# Altium project PCB_Project_IMX7.PrjPCB (part 7 of 9)
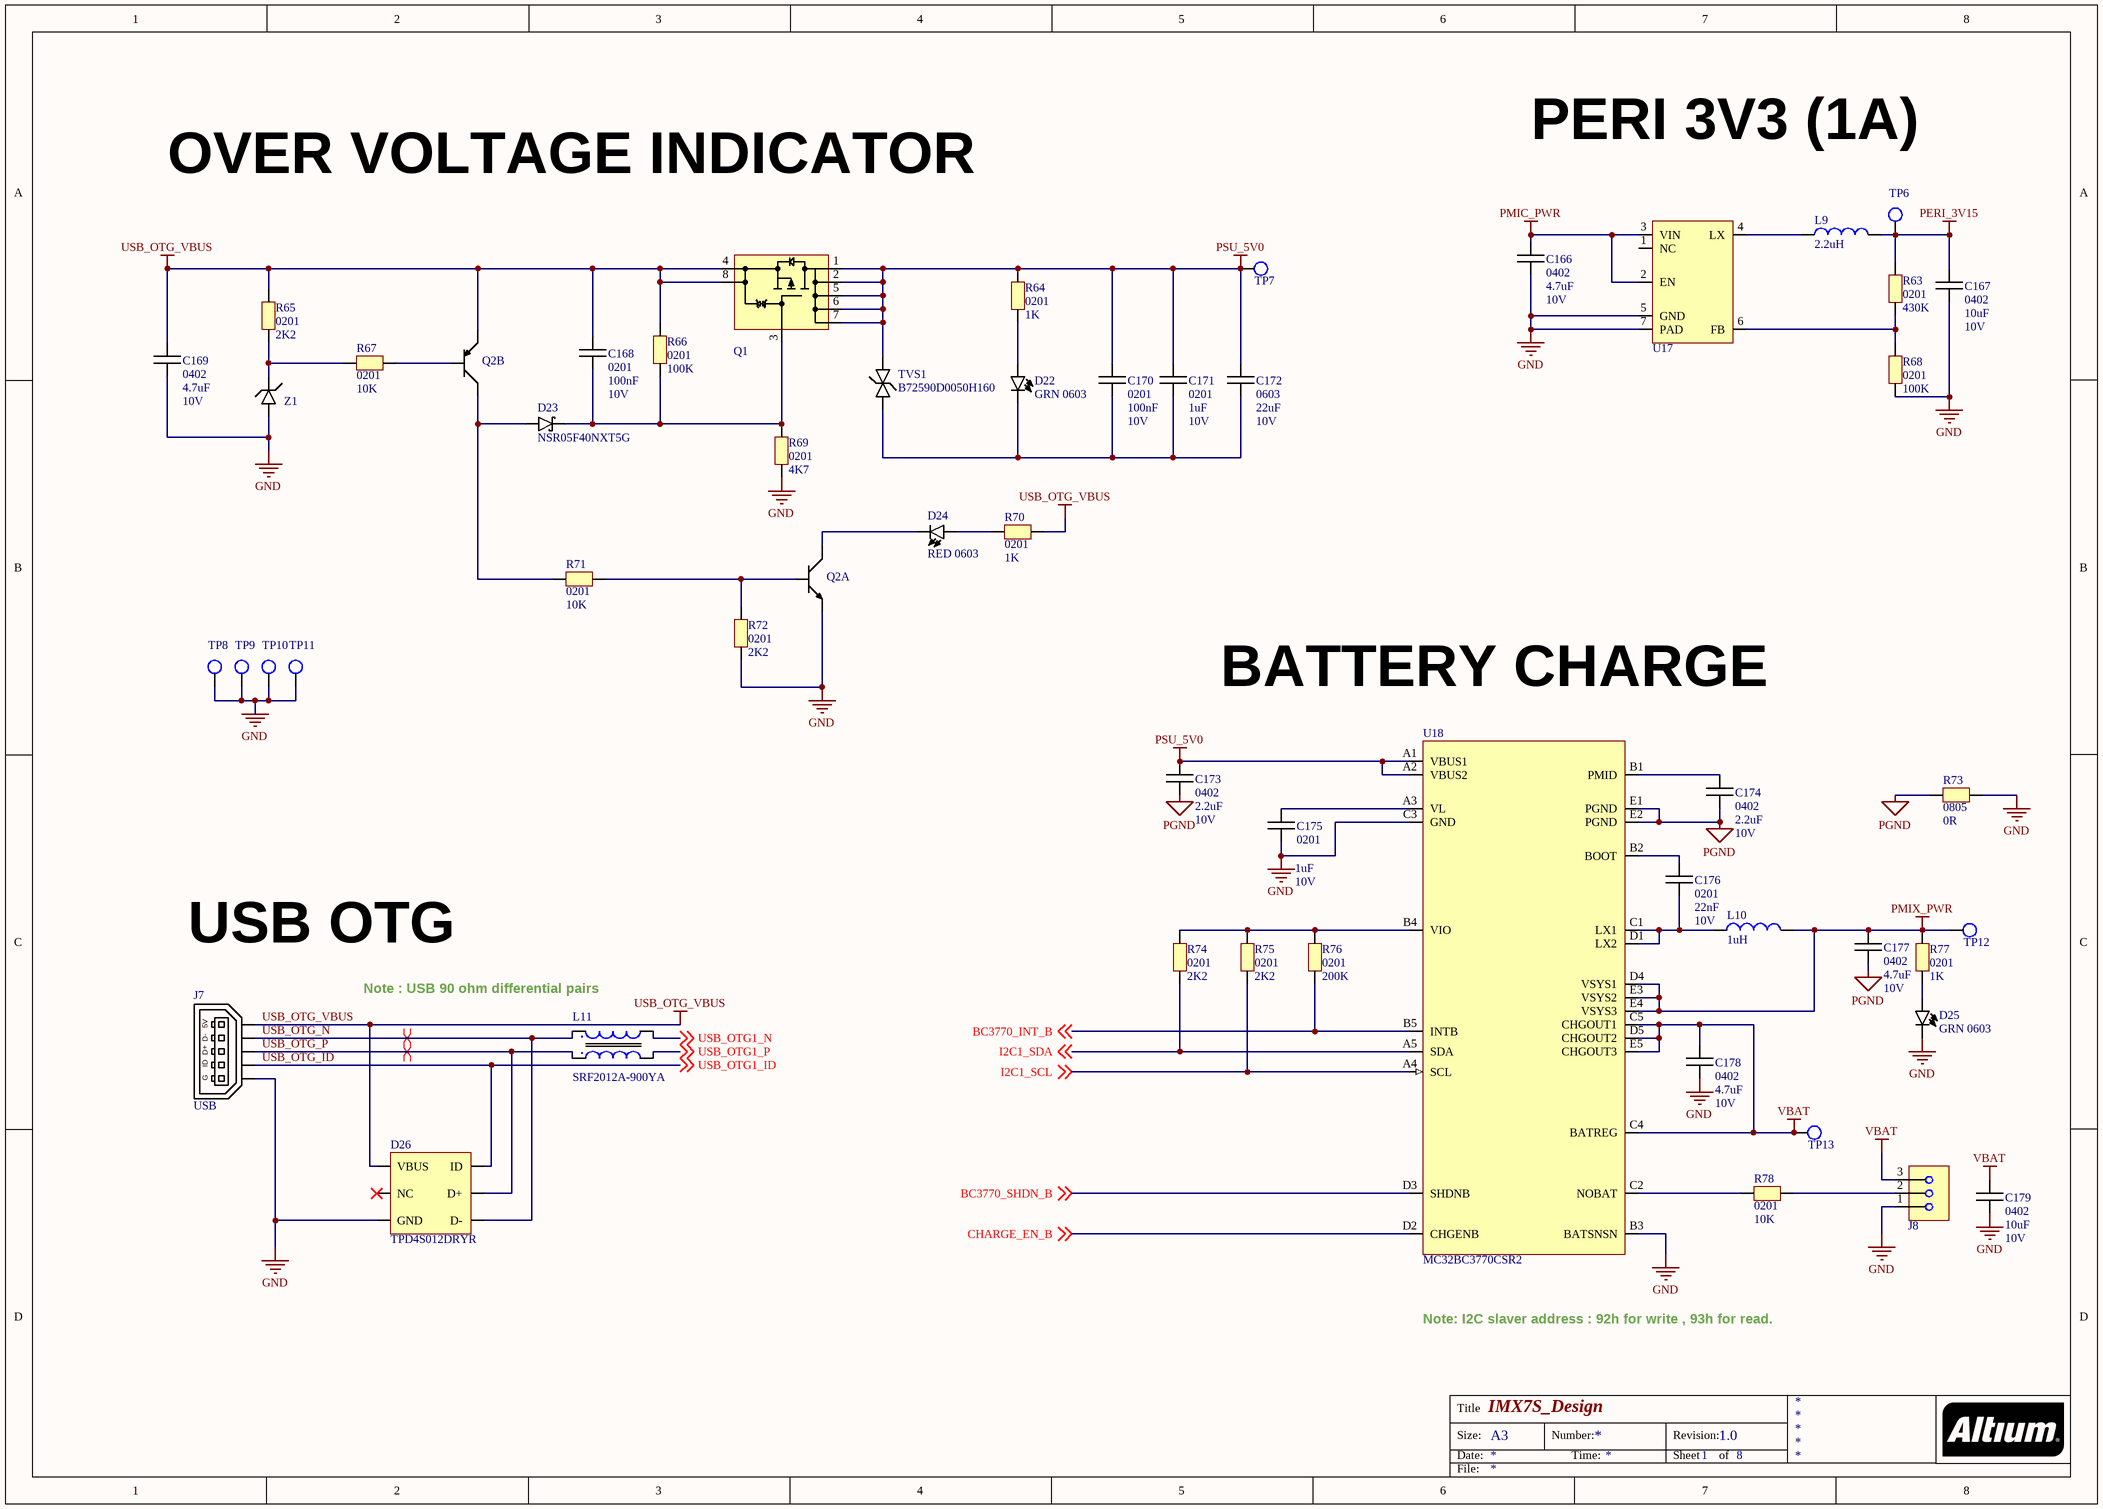
[diagram p111: IMX7S_POWER.SchDoc]

## Sheet IMX7S_POWER.SchDoc: IMX7S_Design (continued)

### Library data of the parts
C166 C169 C177 C178 = C0402: as C151 on sheet IMX7S_WIRELESS; Supplier 1: Farnell; Supplier Part Number 1: 2688503; Stock 1: 566816; Pricing 1: 10=0,19300, 100=0,08330, 500=0,05910, 2500=0,04130, 5000=0,03540, 10000=0,02750, 50000=0,02700 (EUR); Case/Package: 0402; ComponentLink1URL: http://www.farnell.com/datasheets/2189109.pdf?src-supplier=Farnell; ComponentLink1Description: http://www.farnell.com/datasheets/2189109.pdf?src-supplier=Farnell; ComponentLink2URL: https://search.murata.co.jp/Ceramy/image/img/A01X/G101/ENG/GRM155R61A475MEAA-01.pdf?src-supplier=Digi-Key; ComponentLink2Description: https://search.murata.co.jp/Ceramy/image/img/A01X/G101/ENG/GRM155R61A475MEAA-01.pdf?src-supplier=Digi-Key; ComponentLink3URL: http://datasheet.octopart.com/GRM155R61A475MEAAD-Murata-datasheet-68589269.pdf?src-supplier=Newark; ComponentLink3Description: http://datasheet.octopart.com/GRM155R61A475MEAAD-Murata-datasheet-68589269.pdf?src-supplier=Newark; ComponentLink4URL: http://datasheet.octopart.com/GRM155R61A475MEAAD-Murata-datasheet-8819587.pdf; ComponentLink4Description: http://datasheet.octopart.com/GRM155R61A475MEAAD-Murata-datasheet-8819587.pdf; ComponentLink5URL: http://datasheet.octopart.com/GRM155R61A475MEAAD-Murata-datasheet-10025737.pdf; ComponentLink5Description: http://datasheet.octopart.com/GRM155R61A475MEAAD-Murata-datasheet-10025737.pdf; ComponentLink6URL: http://datasheet.octopart.com/GRM155R61A475MEAAD-Murata-datasheet-11978611.pdf; ComponentLink6Description: http://datasheet.octopart.com/GRM155R61A475MEAAD-Murata-datasheet-11978611.pdf; ComponentLink7URL: http://datasheet.octopart.com/GRM155R61A475MEAAD-Murata-datasheet-12510076.pdf; ComponentLink7Description: http://datasheet.octopart.com/GRM155R61A475MEAAD-Murata-datasheet-12510076.pdf; ComponentLink8URL: http://datasheet.octopart.com/GRM155R61A475MEAAD-Murata-datasheet-12515295.pdf; ComponentLink8Description: http://datasheet.octopart.com/GRM155R61A475MEAAD-Murata-datasheet-12515295.pdf
C167 = C0402: Manufacturer 1: Murata; Manufacturer Part Number 1: GRM155R60J106ME44D; Description: Smd Multilayer Ceramic Capacitor, Grm Series, 10 F, 20%, X5r, 6.3 V, 0402 [1005 Metric]; Tolerance: 20%; Voltage Rating: 6.3V; Dielectric: X5R; Supplier 1: Farnell; Supplier Part Number 1: 2666402; Stock 1: 2030000; Pricing 1: 10000=0,05500, 50000=0,04130 (EUR); RoHS: Yes; Mount: Surface Mount; Case/Package: 0402; Case Code (Imperial): 0402; Case Code (Metric): 1005; Min Operating Temperature: -55°C; Max Operating Temperature: 85°C; Packaging: Tape and Reel; Package Quantity: 10000; Capacitance: 10uF; Voltage Rating (DC): 6.3V; Termination: SMD/SMT; Length: 1mm; Height: 0.5mm; Width: 0.5mm; Thickness: 0.022inch; Depth: 0.5mm; REACH SVHC: No SVHC; Lead Free: Lead Free; ComponentLink1URL: http://www.mouser.com/ds/2/281/c02e-2905.pdf?src-supplier=Mouser; ComponentLink1Description: http://www.mouser.com/ds/2/281/c02e-2905.pdf?src-supplier=Mouser; ComponentLink2URL: http://www.farnell.com/datasheets/1666664.pdf?src-supplier=Farnell; ComponentLink2Description: http://www.farnell.com/datasheets/1666664.pdf?src-supplier=Farnell; ComponentLink3URL: http://components.arrow.com/part/dataview/50476202S8987292N2606?src-supplier=Arrow; ComponentLink3Description: http://components.arrow.com/part/dataview/50476202S8987292N2606?src-supplier=Arrow; ComponentLink4URL: http://uk.rs-online.com/webdocs/13b3/0900766b813b3e5a.pdf?src-supplier=RSComponents; ComponentLink4Description: http://uk.rs-online.com/webdocs/13b3/0900766b813b3e5a.pdf?src-supplier=RSComponents; ComponentLink5URL: http://www.farnell.com/datasheets/1889704.pdf?src-supplier=Farnell; ComponentLink5Description: http://www.farnell.com/datasheets/1889704.pdf?src-supplier=Farnell; ComponentLink6URL: http://components.arrow.com/part/dataview/0323_07121522?src-supplier=Arrow+Europe; ComponentLink6Description: http://components.arrow.com/part/dataview/0323_07121522?src-supplier=Arrow+Europe; ComponentLink7URL: http://www.farnell.com/datasheets/1889704.pdf?src-supplier=Element14; ComponentLink7Description: http://www.farnell.com/datasheets/1889704.pdf?src-supplier=Element14; ComponentLink8URL: http://www.murata.com/en-global/about/newsroom/news/product/capacitor/2010/0510?src-supplier=Avnet; ComponentLink8Description: http://www.murata.com/en-global/about/newsroom/news/product/capacitor/2010/0510?src-supplier=Avnet; ComponentLink9URL: https://www.murata.com/~/media/webrenewal/support/library/catalog/products/capacitor/mlcc/c02e.ashx?la=en-us&src-supplier=Digi-Key; ComponentLink9Description: https://www.murata.com/~/media/webrenewal/support/library/catalog/products/capacitor/mlcc/c02e.ashx?la=en-us&src-supplier=Digi-Key; ComponentLink10URL: http://www.farnell.com/datasheets/1889704.pdf?src-supplier=Newark; ComponentLink10Description: http://www.farnell.com/datasheets/1889704.pdf?src-supplier=Newark
C168 C170 = C0201: as C136-C138 on sheet IMX7S_SENSORS_&_EXTERNAL_INTERFACES; Supplier 1: Farnell; Supplier Part Number 1: 2666355; Stock 1: 2430000; Pricing 1: 15000=0,00510, 75000=0,00310 (EUR); RoHS: Yes; Mount: Surface Mount; Case/Package: 0201; Weight: 6E-06oz; Case Code (Metric): 0603; Case Code (Imperial): 0201; Min Operating Temperature: -55°C; Max Operating Temperature: 85°C; Packaging: Tape and Reel; Capacitance: 100nF; Package Quantity: 1; Voltage Rating (DC): 10V; Termination: SMD/SMT; Voltage Rating: 10V; Length: 0.6mm; Height: 0.3mm; Width: 0.012inch; Thickness: 0.013inch; Depth: 0.3mm; Radiation Hardening: No; REACH SVHC: No SVHC; Lead Free: Lead Free; ComponentLink1URL: https://datasheet.ciiva.com/26843/getdatasheetpartid-308656-26843739.pdf?src-supplier=Verical; ComponentLink1Description: https://datasheet.ciiva.com/26843/getdatasheetpartid-308656-26843739.pdf?src-supplier=Verical; ComponentLink2URL: https://datasheet.ciiva.com/5413/product-5413117.pdf?src-supplier=Mouser; ComponentLink2Description: https://datasheet.ciiva.com/5413/product-5413117.pdf?src-supplier=Mouser; ComponentLink3URL: https://datasheet.ciiva.com/6256/partnumbering-e-01-6256406.pdf?src-supplier=Digi-Key; ComponentLink3Description: https://datasheet.ciiva.com/6256/partnumbering-e-01-6256406.pdf?src-supplier=Digi-Key; ComponentLink4URL: https://datasheet.ciiva.com/6256/partnumbering-e-01-6256408.pdf?src-supplier=Digi-Key; ComponentLink4Description: https://datasheet.ciiva.com/6256/partnumbering-e-01-6256408.pdf?src-supplier=Digi-Key; ComponentLink5URL: https://datasheet.ciiva.com/6256/partnumbering-e-01-6256407.pdf?src-supplier=Digi-Key; ComponentLink5Description: https://datasheet.ciiva.com/6256/partnumbering-e-01-6256407.pdf?src-supplier=Digi-Key
C171 C175 = C0201: as C7 on sheet IMX7S_CONNECTORS_&_IHM; Supplier 1: Farnell; Supplier Part Number 1: 2666353; Stock 1: 165000; Pricing 1: 15000=0,01430, 75000=0,01240 (EUR); RoHS: Yes; Mount: Surface Mount; Case/Package: 0201; Weight: 1.2E-05oz; Case Code (Imperial): 0201; Case Code (Metric): 0603; Min Operating Temperature: -55°C; Max Operating Temperature: 85°C; Package Quantity: 1; Packaging: Cut Tape; Capacitance: 1uF; Voltage Rating (DC): 6.3V; Termination: SMD/SMT; Length: 0.6mm; Height: 0.3mm; Width: 0.3mm; Depth: 0.3mm; Thickness: 300um; REACH SVHC: No SVHC; Lead Free: Lead Free; ComponentLink1URL: https://datasheet.ciiva.com/18699/grm033r60j105mea2-02-18699520.pdf?src-supplier=Digi-Key; ComponentLink1Description: https://datasheet.ciiva.com/18699/grm033r60j105mea2-02-18699520.pdf?src-supplier=Digi-Key; ComponentLink2URL: https://datasheet.ciiva.com/24218/c02e-24218376.pdf?src-supplier=Mouser; ComponentLink2Description: https://datasheet.ciiva.com/24218/c02e-24218376.pdf?src-supplier=Mouser; ComponentLink3URL: https://datasheet.ciiva.com/18699/partnumbering-e-01-18699519.pdf?src-supplier=Digi-Key; ComponentLink3Description: https://datasheet.ciiva.com/18699/partnumbering-e-01-18699519.pdf?src-supplier=Digi-Key
C172 = C0603: as C9-C12 on sheet IMX7S_CONNECTORS_&_IHM; Supplier 1: Farnell; Supplier Part Number 1: 2666490; Stock 1: 3836000; Pricing 1: 4000=0,03830, 20000=0,03750 (EUR); RoHS: Yes; Mount: Surface Mount; Case/Package: 0603; Weight: 0.000222oz; Case Code (Metric): 1608; Case Code (Imperial): 0603; Min Operating Temperature: -55°C; Max Operating Temperature: 85°C; Capacitance: 22uF; Packaging: Tape and Reel; Package Quantity: 4000; Termination: SMD/SMT; Voltage Rating (DC): 6.3V; Length: 1.6mm; Height: 0.8mm; Width: 0.8mm; Thickness: 0.039inch; Depth: 0.8mm; REACH SVHC: No SVHC; Lead Free: Lead Free; ComponentLink1URL: https://datasheet.ciiva.com/29540/partnumbering-e-01-29540443.pdf?src-supplier=Digi-Key; ComponentLink1Description: https://datasheet.ciiva.com/29540/partnumbering-e-01-29540443.pdf?src-supplier=Digi-Key; ComponentLink2URL: https://datasheet.ciiva.com/29540/partnumbering-e-01-29540441.pdf?src-supplier=Digi-Key; ComponentLink2Description: https://datasheet.ciiva.com/29540/partnumbering-e-01-29540441.pdf?src-supplier=Digi-Key; ComponentLink3URL: https://datasheet.ciiva.com/29540/partnumbering-e-01-29540442.pdf?src-supplier=Digi-Key; ComponentLink3Description: https://datasheet.ciiva.com/29540/partnumbering-e-01-29540442.pdf?src-supplier=Digi-Key
C173 C174 = C0402: as C150 on sheet IMX7S_WIRELESS; Supplier 1: Farnell; Supplier Part Number 1: 2533930; Stock 1: 11802; Pricing 1: 10=0,21600, 100=0,14100, 500=0,10600, 2500=0,09320, 5000=0,07880, 10000=0,07420, 50000=0,06950 (EUR); RoHS: Yes; Mount: Surface Mount; Case/Package: 0402; Case Code (Metric): 1005; Case Code (Imperial): 0402; Min Operating Temperature: -55°C; Max Operating Temperature: 85°C; Packaging: Tape and Reel; Capacitance: 2.2uF; Voltage Rating: 10V; Length: 0.039inch; Width: 0.02inch; Thickness: 0.022inch; ComponentLink1URL: http://www.farnell.com/datasheets/2031748.pdf?src-supplier=Farnell; ComponentLink1Description: http://www.farnell.com/datasheets/2031748.pdf?src-supplier=Farnell; ComponentLink2URL: https://katalog.we-online.de/pbs/datasheet/885012105013.pdf?src-supplier=Digi-Key; ComponentLink2Description: https://katalog.we-online.de/pbs/datasheet/885012105013.pdf?src-supplier=Digi-Key
C176 = C0201: Manufacturer 1: Multicomp; Manufacturer Part Number 1: MC0201X223K6R3CT; Description: MULTICOMP - MC0201X223K6R3CT - CAP, 0.022µF, 6.3V, 10%, X5R, 0201; Tolerance: 10%; Voltage Rating: 6.3V; Dielectric: X5R; Supplier 1: Farnell; Supplier Part Number 1: 1758842; Stock 1: 24150; Pricing 1: 10=0,02310, 100=0,01870, 500=0,01330, 2500=0,00920, 7500=0,00650, 15000=0,00530, 75000=0,00360, 150000=0,00350 (EUR); RoHS: Yes; Case/Package: 0201; Number of Pins: 2; Case Code (Metric): 0603; Case Code (Imperial): 0201; Min Operating Temperature: -55°C; Max Operating Temperature: 85°C; Capacitance: 22nF; Packaging: Cut Tape; Voltage Rating (DC): 6.3V; Width: 0.3mm; REACH SVHC: Unknown; ComponentLink1URL: https://datasheet.ciiva.com/46418/1870456-46418125.pdf?src-supplier=Element14; ComponentLink1Description: https://datasheet.ciiva.com/46418/1870456-46418125.pdf?src-supplier=Element14; ComponentLink2URL: https://datasheet.ciiva.com/46418/1870456-46418124.pdf?src-supplier=Element14; ComponentLink2Description: https://datasheet.ciiva.com/46418/1870456-46418124.pdf?src-supplier=Element14
C179 = C0402: Manufacturer 1: Murata; Manufacturer Part Number 1: GRM155R60J106ME44D; Tolerance: 20%; Voltage Rating: 6.3V; Dielectric: X5R; Supplier 1: Farnell; Supplier Part Number 1: 2666402; Stock 1: 2120000; Pricing 1: 10000=0,05500, 50000=0,04130 (EUR); RoHS: Yes; Mount: Surface Mount; Case/Package: 0402; Case Code (Imperial): 0402; Case Code (Metric): 1005; Min Operating Temperature: -55°C; Max Operating Temperature: 85°C; Packaging: Tape and Reel; Package Quantity: 10000; Capacitance: 10uF; Voltage Rating (DC): 6.3V; Termination: SMD/SMT; Length: 1mm; Height: 0.5mm; Width: 0.5mm; Thickness: 0.022inch; Depth: 0.5mm; REACH SVHC: No SVHC; Lead Free: Lead Free; ComponentLink1URL: http://www.farnell.com/datasheets/1666664.pdf?src-supplier=Farnell; ComponentLink1Description: http://www.farnell.com/datasheets/1666664.pdf?src-supplier=Farnell; ComponentLink2URL: http://components.arrow.com/part/dataview/50476202S8987292N2606?src-supplier=Arrow; ComponentLink2Description: http://components.arrow.com/part/dataview/50476202S8987292N2606?src-supplier=Arrow; ComponentLink3URL: http://uk.rs-online.com/webdocs/13b3/0900766b813b3e5a.pdf?src-supplier=RSComponents; ComponentLink3Description: http://uk.rs-online.com/webdocs/13b3/0900766b813b3e5a.pdf?src-supplier=RSComponents; ComponentLink4URL: http://www.mouser.com/ds/2/281/c02e-2905.pdf?src-supplier=Mouser; ComponentLink4Description: http://www.mouser.com/ds/2/281/c02e-2905.pdf?src-supplier=Mouser; ComponentLink5URL: http://www.farnell.com/datasheets/1889704.pdf?src-supplier=Farnell; ComponentLink5Description: http://www.farnell.com/datasheets/1889704.pdf?src-supplier=Farnell; ComponentLink6URL: http://components.arrow.com/part/dataview/0323_07121522?src-supplier=Arrow+Europe; ComponentLink6Description: http://components.arrow.com/part/dataview/0323_07121522?src-supplier=Arrow+Europe; ComponentLink7URL: http://www.farnell.com/datasheets/1889704.pdf?src-supplier=Element14; ComponentLink7Description: http://www.farnell.com/datasheets/1889704.pdf?src-supplier=Element14; ComponentLink8URL: http://www.murata.com/en-global/about/newsroom/news/product/capacitor/2010/0510?src-supplier=Avnet; ComponentLink8Description: http://www.murata.com/en-global/about/newsroom/news/product/capacitor/2010/0510?src-supplier=Avnet; ComponentLink9URL: https://www.murata.com/~/media/webrenewal/support/library/catalog/products/capacitor/mlcc/c02e.ashx?la=en-us&src-supplier=Digi-Key; ComponentLink9Description: https://www.murata.com/~/media/webrenewal/support/library/catalog/products/capacitor/mlcc/c02e.ashx?la=en-us&src-supplier=Digi-Key; ComponentLink10URL: http://www.farnell.com/datasheets/1889704.pdf?src-supplier=Newark; ComponentLink10Description: http://www.farnell.com/datasheets/1889704.pdf?src-supplier=Newark
D22 D25 = LED: Manufacturer 1: Kingbright; Manufacturer Part Number 1: KPGA-1602CGC-KA; Color: Green; Luminous Intensity: 30mcd; Viewing Angle: 160°; Forward Voltage: 2.05V; Wavelength: 571nm; Forward Current: 20mA; Lens Style: Rectangular; Supplier 1: Farnell; Supplier Part Number 1: 2373522; Stock 1: 0; Pricing 1: 1=0,22200, 10=0,20400, 50=0,18700, 100=0,17400, 500=0,16300, 2000=0,15600, 4000=0,15100, 20000=0,14500 (EUR); RoHS: Yes; Case/Package: SMD/SMT; REACH SVHC: No SVHC; ComponentLink1URL: https://datasheet.ciiva.com/28496/1776625-28496563.pdf?src-supplier=Element14; ComponentLink1Description: https://datasheet.ciiva.com/28496/1776625-28496563.pdf?src-supplier=Element14
D23 = Shotky: Manufacturer 1: ON Semiconductor; Max Surge Current: 10A; Forward Voltage: 460mV; Max Power Dissipation: 1.3W; Forward Current: 500mA; Peak Reverse Current: 75uA; Max Reverse Leakage Current: 15uA; Max Repetitive Reverse Voltage (Vrrm): 40V; Element Configuration: Single; Supplier 1: Farnell; Supplier Part Number 1: 2317565; Manufacturer Part Number 1: NSR05F40NXT5G; Stock 1: 1596; Pricing 1: 5=0,30700, 25=0,29500, 100=0,15000, 250=0,14600, 500=0,12800, 1000=0,10900, 5000=0,08830 (EUR); RoHS: Yes; Case/Package: 0402; Number of Pins: 2; Contact Plating: Tin,Matte; Min Operating Temperature: -40°C; Max Operating Temperature: 150°C; Package Quantity: 1; Packaging: Tape and Reel; Average Rectified Current: 500mA; Peak Non-Repetitive Surge Current: 10A; Max Forward Surge Current (Ifsm): 10A; Max Reverse Voltage (DC): 40V; Radiation Hardening: No; REACH SVHC: No SVHC; Lead Free: Lead Free; ComponentLink1URL: https://datasheet.ciiva.com/4245/18nsr05f40-d-4245393.pdf?src-supplier=Arrow; ComponentLink1Description: https://datasheet.ciiva.com/4245/18nsr05f40-d-4245393.pdf?src-supplier=Arrow; ComponentLink2URL: https://datasheet.ciiva.com/4713/nsr05f40-97881-4713880.pdf?src-supplier=Mouser; ComponentLink2Description: https://datasheet.ciiva.com/4713/nsr05f40-97881-4713880.pdf?src-supplier=Mouser; ComponentLink3URL: https://datasheet.ciiva.com/22664/1707331-22664188.pdf?src-supplier=Element14; ComponentLink3Description: https://datasheet.ciiva.com/22664/1707331-22664188.pdf?src-supplier=Element14
D24 = LED: Manufacturer 1: Dialight; Manufacturer Part Number 1: 597-5112-407F; Lens Color: White; Luminous Intensity: 11.7mcd; Viewing Angle: 152°; Forward Voltage: 1.7V; Wavelength: 660nm; Lens Style: Rectangular,Diffused; Forward Current: 20mA; Lens Transparency: Diffused; Dominant Wavelength: 647nm; Number of Elements: 1; Power Dissipation: 57.5mW; Supplier 1: Farnell; Supplier Part Number 1: 2410206; Stock 1: 4000; Pricing 1: 4000=0,23100, 8000=0,22100, 16000=0,21300 (EUR); RoHS: Yes; Mount: Surface Mount; Case/Package: 0603; Number of Pins: 2; Color: Red; Case Code (Metric): 1608; Case Code (Imperial): 0603; Min Operating Temperature: -30°C; Max Operating Temperature: 85°C; Packaging: Tape and Reel; Package Quantity: 1; Illumination Color: Red; Test Current: 20mA; Voltage Rating (DC): 1.7V; Input Current: 20mA; Number of LEDs: 1; Length: 1.6mm; Height: 0.7mm; Width: 0.8mm; Depth: 0.8mm; Radiation Hardening: No; REACH SVHC: No SVHC; Lead Free: Lead Free; ComponentLink1URL: https://datasheet.ciiva.com/15117/getdatasheetpartid-87981-15117375.pdf?src-supplier=Verical; ComponentLink1Description: https://datasheet.ciiva.com/15117/getdatasheetpartid-87981-15117375.pdf?src-supplier=Verical; ComponentLink2URL: https://datasheet.ciiva.com/4688/c16413e-14555-4688795.pdf?src-supplier=Mouser; ComponentLink2Description: https://datasheet.ciiva.com/4688/c16413e-14555-4688795.pdf?src-supplier=Mouser; ComponentLink3URL: https://datasheet.ciiva.com/2111/c16413-2111592.pdf?src-supplier=Digi-Key; ComponentLink3Description: https://datasheet.ciiva.com/2111/c16413-2111592.pdf?src-supplier=Digi-Key; ComponentLink4URL: https://datasheet.ciiva.com/16214/597-xxxx-4xx-16214360.pdf?src-supplier=Future+Electronics; ComponentLink4Description: https://datasheet.ciiva.com/16214/597-xxxx-4xx-16214360.pdf?src-supplier=Future+Electronics; ComponentLink5URL: https://datasheet.ciiva.com/30210/597-xxxx-4xx-30210171.pdf?src-supplier=Onlinecomponents.com; ComponentLink5Description: https://datasheet.ciiva.com/30210/597-xxxx-4xx-30210171.pdf?src-supplier=Onlinecomponents.com; ComponentLink6URL: https://datasheet.ciiva.com/16011/597-xxxx-4xx-16011468.pdf?src-supplier=Onlinecomponents.com; ComponentLink6Description: https://datasheet.ciiva.com/16011/597-xxxx-4xx-16011468.pdf?src-supplier=Onlinecomponents.com; ComponentLink7URL: https://datasheet.ciiva.com/2111/c16413-2111593.pdf?src-supplier=Digi-Key; ComponentLink7Description: https://datasheet.ciiva.com/2111/c16413-2111593.pdf?src-supplier=Digi-Key; ComponentLink8URL: https://datasheet.ciiva.com/2111/c16413-2111594.pdf?src-supplier=Digi-Key; ComponentLink8Description: https://datasheet.ciiva.com/2111/c16413-2111594.pdf?src-supplier=Digi-Key
D26 = TPD4S012DRYR: Manufacturer 1: Texas Instruments; Capacitance: 15pF; Direction: Unidirectional; Operating Supply Voltage: 950mV; Number of Circuits: 4; Breakdown Voltage: 24V; Max Power Dissipation: 60W; Working Voltage: 19V; Min Breakdown Voltage: 6V; ESD Protection: Yes; Test Current: 1mA; Peak Pulse Current: 3A; Interface: USB; Supplier 1: Mouser; Supplier Part Number 1: 595-TPD4S012DRYR; Manufacturer Part Number 1: TPD4S012DRYR; Stock 1: 74516; Pricing 1: 1=0,69000, 10=0,57000, 50=0,57000, 100=0,37000, 1000=0,29600, 2000=0,26900, 5000=0,25000, 10000=0,24100, 25000=0,23200, 50000=0,22300 (USD); RoHS: Yes; Number of Pins: 6; Min Operating Temperature: -40°C; Max Operating Temperature: 85°C; Packaging: Tape and Reel; Package Quantity: 5000; Polarity: Unidirectional; Number of Channels: 4; Termination: SMD/SMT; Peak Pulse Power: 60W; Length: 1.45mm; Height: 0.55mm; Width: 1.05mm; Depth: 1mm; Radiation Hardening: No; REACH SVHC: No SVHC; Lead Free: Lead Free; ComponentLink1URL: https://datasheet.ciiva.com/361/tpd4s012-361280.pdf?src-supplier=Digi-Key; ComponentLink1Description: https://datasheet.ciiva.com/361/tpd4s012-361280.pdf?src-supplier=Digi-Key; ComponentLink2URL: https://datasheet.ciiva.com/4479/slvs928a-120928-4479536.pdf?src-supplier=Mouser; ComponentLink2Description: https://datasheet.ciiva.com/4479/slvs928a-120928-4479536.pdf?src-supplier=Mouser; ComponentLink3URL: https://datasheet.ciiva.com/25956/tpd4s012-25956897.pdf?src-supplier=Avnet+Europe; ComponentLink3Description: https://datasheet.ciiva.com/25956/tpd4s012-25956897.pdf?src-supplier=Avnet+Europe; ComponentLink4URL: https://datasheet.ciiva.com/1271/1719848-1271898.pdf?src-supplier=Farnell; ComponentLink4Description: https://datasheet.ciiva.com/1271/1719848-1271898.pdf?src-supplier=Farnell; ComponentLink5URL: https://datasheet.ciiva.com/15104/getdatasheetpartid-293634-15104046.pdf?src-supplier=Verical; ComponentLink5Description: https://datasheet.ciiva.com/15104/getdatasheetpartid-293634-15104046.pdf?src-supplier=Verical; ComponentLink6URL: https://datasheet.ciiva.com/46381/1857625-46381802.pdf?src-supplier=Element14; ComponentLink6Description: https://datasheet.ciiva.com/46381/1857625-46381802.pdf?src-supplier=Element14; ComponentLink7URL: https://datasheet.ciiva.com/28496/tpd4s012-28496124.pdf?src-supplier=Element14; ComponentLink7Description: https://datasheet.ciiva.com/28496/tpd4s012-28496124.pdf?src-supplier=Element14; ComponentLink8URL: https://datasheet.ciiva.com/1268/tpd4s012-1268381.pdf?src-supplier=Element14; ComponentLink8Description: https://datasheet.ciiva.com/1268/tpd4s012-1268381.pdf?src-supplier=Element14; ComponentLink9URL: https://datasheet.ciiva.com/361/tpd4s012-361278.pdf?src-supplier=Digi-Key; ComponentLink9Description: https://datasheet.ciiva.com/361/tpd4s012-361278.pdf?src-supplier=Digi-Key; ComponentLink10URL: https://datasheet.ciiva.com/22621/1857625-22621486.pdf?src-supplier=Element14; ComponentLink10Description: https://datasheet.ciiva.com/22621/1857625-22621486.pdf?src-supplier=Element14; ComponentLink11URL: https://datasheet.ciiva.com/361/tpd4s012-361279.pdf?src-supplier=Digi-Key; ComponentLink11Description: https://datasheet.ciiva.com/361/tpd4s012-361279.pdf?src-supplier=Digi-Key
J7 = MICRO_USB: Manufacturer 1: Hirose; Manufacturer Part Number 1: ZX62D-AB-5P8(30); Number of Contacts: 5; Gender: Receptacle; USB Standard: USB 2.0; Supplier 1: Farnell; Supplier Part Number 1: 2554979; Stock 1: 34; Pricing 1: 1=0,67500, 60=0,64500, 200=0,58600, 500=0,52700, 1000=0,47000 (EUR); RoHS: Yes; Mount: Surface Mount,Horizontal; Contact Material: Copper Alloy; Contact Plating: Gold; Packaging: Tape and Reel; Connector Type: USB; Orientation: Right Angle; REACH SVHC: Unknown; Lead Free: Lead Free; ComponentLink1URL: http://www.farnell.com/datasheets/2691174.pdf?src-supplier=Farnell; ComponentLink1Description: http://www.farnell.com/datasheets/2691174.pdf?src-supplier=Farnell; ComponentLink2URL: https://www.hirose.com/product/en/download_file/key_name/ZX62D-AB-5P8%2830%29/category/Specification%20Sheet/doc_file_id/87466/?file_category_id=9&item_id=02420027530&is_series=&src-supplier=Digi-Key; ComponentLink2Description: https://www.hirose.com/product/en/download_file/key_name/ZX62D-AB-5P8%2830%29/category/Specification%20Sheet/doc_file_id/87466/?file_category_id=9&item_id=02420027530&is_series=&src-supplier=Digi-Key; ComponentLink3URL: http://www.farnell.com/datasheets/2060515.pdf?src-supplier=Element14; ComponentLink3Description: http://www.farnell.com/datasheets/2060515.pdf?src-supplier=Element14; ComponentLink4URL: http://www.farnell.com/datasheets/2691174.pdf?src-supplier=Newark; ComponentLink4Description: http://www.farnell.com/datasheets/2691174.pdf?src-supplier=Newark
L9 = Self: Manufacturer 1: Bourns; Manufacturer Part Number 1: SRN5040-2R2Y; Core Material: Ferrite; Tolerance: 30%; Current Rating: 3.5A; Saturation Current: 4.6A; Shielding: Unshielded; DC Resistance (DCR): 21mR; Self Resonant Frequency: 40MHz; Test Frequency: 100kHz; Supplier 1: Farnell; Supplier Part Number 1: 2859270; Stock 1: 10000; Pricing 1: 1000=0,16400, 5000=0,14900 (EUR); RoHS: Yes; Mount: Surface Mount; Case/Package: 2020; Contact Plating: Tin; Min Operating Temperature: -40°C; Max Operating Temperature: 125°C; Packaging: Cut Tape; Inductance Tolerance: 30%; Composition: Wirewound; Inductance: 2.2uH; Max DC Current: 3.5A; Termination: SMD/SMT; RMS Current (Irms): 3.5A; DC Current: 3.5A; Military Standard: Not; Length: 5mm; Height: 4mm; Width: 0.197inch; Height - Seated (Max): 0.157inch; Depth: 5.2mm; REACH SVHC: No SVHC; ComponentLink1URL: https://datasheet.ciiva.com/46437/1824805-46437432.pdf?src-supplier=Element14; ComponentLink1Description: https://datasheet.ciiva.com/46437/1824805-46437432.pdf?src-supplier=Element14; ComponentLink2URL: https://datasheet.ciiva.com/46437/1824805-46437433.pdf?src-supplier=Element14; ComponentLink2Description: https://datasheet.ciiva.com/46437/1824805-46437433.pdf?src-supplier=Element14
L10 = Self: Manufacturer 1: Coilcraft; Manufacturer Part Number 1: PFL1005-102MRU; Core Material: Composite; Inductance Tolerance: 20%; Self Resonant Frequency: 450MHz; Shielding: Shielded; Max DC Current: 400mA; DC Resistance (DCR): 1.05R; Test Frequency: 7.9MHz; Saturation Current: 270mA; Supplier 1: Farnell; Supplier Part Number 1: 2288731; Stock 1: 2293; Pricing 1: 5=0,94000, 50=0,57800, 250=0,52400, 500=0,45900, 1000=0,41300, 2000=0,38600, 10000=0,37900 (EUR); RoHS: Yes; Case/Package: SMD/SMT; Min Operating Temperature: -40°C; Max Operating Temperature: 85°C; Packaging: Cut Tape; Tolerance: 20%; Inductance: 1uH; Termination: SMD/SMT; RMS Current (Irms): 400mA; Length: 1.14mm; Height: 0.71mm; Width: 0.635mm; REACH SVHC: No SVHC; Lead Free: Contains Lead; ComponentLink1URL: https://datasheet.ciiva.com/22708/1681962-22708912.pdf?src-supplier=Element14; ComponentLink1Description: https://datasheet.ciiva.com/22708/1681962-22708912.pdf?src-supplier=Element14
L11 = SRF2012A-900YA: Manufacturer 1: Bourns; Resistance: 90R; Number of Lines: 2; DC Resistance (DCR): 300mR; Voltage Rating (DC): 50V; Current Rating: 400mA; Supplier 1: Farnell; Supplier Part Number 1: 2493820; Manufacturer Part Number 1: SRF2012A-900YA; Stock 1: 31; Pricing 1: 5=0,28300, 50=0,19200, 250=0,16200, 500=0,15300, 1000=0,14500, 2000=0,13800, 10000=0,13000 (EUR); RoHS: Yes; Mount: Surface Mount; Min Operating Temperature: -40°C; Max Operating Temperature: 125°C; Package Quantity: 2000; Packaging: Cut Tape; Impedance: 90R; Max Current Rating: 400mA; Length: 0.079inch; Height: 0.055inch; Width: 0.047inch; Ratings: AEC-Q200; REACH SVHC: No SVHC; ComponentLink1URL: https://media.digikey.com/pdf/Data%20Sheets/Bourns%20PDFs/SRF2012AA_Series_DS.pdf?src-supplier=Digi-Key; ComponentLink1Description: https://media.digikey.com/pdf/Data%20Sheets/Bourns%20PDFs/SRF2012AA_Series_DS.pdf?src-supplier=Digi-Key; ComponentLink2URL: http://www.farnell.com/datasheets/1955468.pdf?src-supplier=Farnell; ComponentLink2Description: http://www.farnell.com/datasheets/1955468.pdf?src-supplier=Farnell; ComponentLink3URL: http://www.farnell.com/datasheets/1955468.pdf?src-supplier=Element14; ComponentLink3Description: http://www.farnell.com/datasheets/1955468.pdf?src-supplier=Element14
Q1 = FDMA530PZ: Manufacturer 1: ON Semiconductor / Fairchild; Input Capacitance: 1.07nF; Max Power Dissipation: 2.4W; Nominal Vgs: 25V; Rise Time: 21ns; Rds On Max: 35mR; Continuous Drain Current (ID): 6.8A; Fall Time: 31ns; Turn-Off Delay Time: 43ns; Drain to Source Voltage (Vdss): 30V; Turn-On Delay Time: 6ns; Drain to Source Breakdown Voltage: -30V; Number of Elements: 1; Threshold Voltage: -2.1V; Element Configuration: Single; Current Rating: -6.8A; Supplier 1: Farnell; Supplier Part Number 1: 1495165; Manufacturer Part Number 1: FDMA530PZ; Stock 1: 12368; Pricing 1: 5=0,75600, 10=0,60800, 100=0,35400, 250=0,31600, 500=0,27800, 1000=0,24000, 5000=0,23100 (EUR); RoHS: Yes; Mount: Surface Mount; Number of Pins: 6; Weight: 0.03g; Min Operating Temperature: -55°C; Max Operating Temperature: 150°C; Packaging: Tape and Reel; Package Quantity: 1; Power Dissipation: 2.4W; Drain to Source Resistance: 35mR; Gate to Source Voltage (Vgs): 25V; On-State Resistance: 35MR; Dual Supply Voltage: -30V; Termination: SMD/SMT; Voltage Rating (DC): -30V; Length: 2mm; Height: 0.75mm; Width: 2mm; REACH SVHC: No SVHC; Lead Free: Lead Free; ComponentLink1URL: https://datasheet.ciiva.com/7967/1576841-7967924.pdf?src-supplier=Element14; ComponentLink1Description: https://datasheet.ciiva.com/7967/1576841-7967924.pdf?src-supplier=Element14; ComponentLink2URL: https://datasheet.ciiva.com/16781/fdma530pz-16781909.pdf?src-supplier=Future+Electronics; ComponentLink2Description: https://datasheet.ciiva.com/16781/fdma530pz-16781909.pdf?src-supplier=Future+Electronics; ComponentLink3URL: https://datasheet.ciiva.com/4441/fdma530pz-95024-4441174.pdf?src-supplier=Mouser; ComponentLink3Description: https://datasheet.ciiva.com/4441/fdma530pz-95024-4441174.pdf?src-supplier=Mouser; ComponentLink4URL: https://datasheet.ciiva.com/22705/1837761-22705020.pdf?src-supplier=Element14; ComponentLink4Description: https://datasheet.ciiva.com/22705/1837761-22705020.pdf?src-supplier=Element14; ComponentLink5URL: https://datasheet.ciiva.com/26791/fdma530pz-26791020.pdf?src-supplier=IIIC; ComponentLink5Description: https://datasheet.ciiva.com/26791/fdma530pz-26791020.pdf?src-supplier=IIIC; ComponentLink6URL: https://datasheet.ciiva.com/26143/fdma530pz-26143338.pdf?src-supplier=Avnet+Europe; ComponentLink6Description: https://datasheet.ciiva.com/26143/fdma530pz-26143338.pdf?src-supplier=Avnet+Europe; ComponentLink7URL: https://datasheet.ciiva.com/932/fdma530pz-932477.pdf?src-supplier=Digi-Key; ComponentLink7Description: https://datasheet.ciiva.com/932/fdma530pz-932477.pdf?src-supplier=Digi-Key; ComponentLink8URL: https://datasheet.ciiva.com/932/fdma530pz-932478.pdf?src-supplier=Digi-Key; ComponentLink8Description: https://datasheet.ciiva.com/932/fdma530pz-932478.pdf?src-supplier=Digi-Key; ComponentLink9URL: https://datasheet.ciiva.com/932/fdma530pz-932479.pdf?src-supplier=Digi-Key; ComponentLink9Description: https://datasheet.ciiva.com/932/fdma530pz-932479.pdf?src-supplier=Digi-Key; ComponentLink10URL: https://datasheet.ciiva.com/11175/fdma530pz-11175535.pdf?src-supplier=Avnet; ComponentLink10Description: https://datasheet.ciiva.com/11175/fdma530pz-11175535.pdf?src-supplier=Avnet
Q2 = HBDM60V600W-7: Manufacturer 1: Diodes; Max Power Dissipation: 200mW; hFE Min: 50; Collector Emitter Voltage (VCEO): 400mV; Frequency: 100MHz; Polarity: NPN,PNP; Max Collector Current: 600mA; Collector Emitter Breakdown Voltage: 60V; Number of Elements: 2; Collector Base Voltage (VCBO): 80V; Element Configuration: Dual; Emitter Base Voltage (VEBO): 6V; Collector Emitter Saturation Voltage: -500mV; Continuous Collector Current: 500mA; Supplier 1: Mouser; Supplier Part Number 1: 621-HBDM60V600W-7; Manufacturer Part Number 1: HBDM60V600W-7; Stock 1: 14460; Pricing 1: 1=0,37000, 10=0,28000, 50=0,28000, 100=0,15200, 1000=0,11400, 3000=0,09800, 9000=0,09200, 10000=0,09200 (USD); RoHS: Yes; Mount: Surface Mount; Case/Package: SOT-363; Number of Pins: 6; Weight: 0.000212oz; Min Operating Temperature: -55°C; Max Operating Temperature: 150°C; Package Quantity: 3000; Packaging: Tape and Reel; Transition Frequency: 100MHz; Max Breakdown Voltage: 60V; Power Dissipation: 200mW; Gain Bandwidth Product: 100MHz; Length: 2.2mm; Height: 1mm; Width: 1.35mm; Radiation Hardening: No; REACH SVHC: No SVHC; ComponentLink1URL: https://datasheet.ciiva.com/11198/ds30701-11198592.pdf?src-supplier=Avnet; ComponentLink1Description: https://datasheet.ciiva.com/11198/ds30701-11198592.pdf?src-supplier=Avnet; ComponentLink2URL: https://datasheet.ciiva.com/4723/ds30701-4723217.pdf?src-supplier=Mouser; ComponentLink2Description: https://datasheet.ciiva.com/4723/ds30701-4723217.pdf?src-supplier=Mouser; ComponentLink3URL: https://datasheet.ciiva.com/15138/getdatasheetpartid-61146-15138937.pdf?src-supplier=Verical; ComponentLink3Description: https://datasheet.ciiva.com/15138/getdatasheetpartid-61146-15138937.pdf?src-supplier=Verical; ComponentLink4URL: https://datasheet.ciiva.com/6362/ds30701-6362758.pdf?src-supplier=Digi-Key; ComponentLink4Description: https://datasheet.ciiva.com/6362/ds30701-6362758.pdf?src-supplier=Digi-Key; ComponentLink5URL: https://datasheet.ciiva.com/17304/ds30701-17304022.pdf?src-supplier=Avnet+Europe; ComponentLink5Description: https://datasheet.ciiva.com/17304/ds30701-17304022.pdf?src-supplier=Avnet+Europe; ComponentLink6URL: https://datasheet.ciiva.com/6362/ds30701-6362759.pdf?src-supplier=Digi-Key; ComponentLink6Description: https://datasheet.ciiva.com/6362/ds30701-6362759.pdf?src-supplier=Digi-Key
R63 = R0201: Manufacturer 1: Vishay; Manufacturer Part Number 1: CRCW0201430KFNED; VOLTAGE: 0V; Description: RES SMD 430K OHM 1% 1/20W 0201; Resistance: 430kR; Tolerance: 1%; Power Rating: 50mW; Voltage Rating: 30V; Temperature Coefficient: 200ppm/°C; Supplier 1: Farnell; Supplier Part Number 1: 2140398; Stock 1: 7400; Pricing 1: 10=0,00730, 100=0,00680, 500=0,00530, 2500=0,00520, 5000=0,00510 (EUR); RoHS: Yes; Case/Package: 0201; Case Code (Metric): 0603; Case Code (Imperial): 0201; Contact Plating: Tin; Min Operating Temperature: -55°C; Max Operating Temperature: 155°C; Packaging: Tape and Reel; Package Quantity: 10000; Composition: Thick Film; Number of Terminations: 2; Max Power Dissipation: 50mW; Voltage Rating (DC): 30V; Length: 0.024inch; Height: 0.011inch; Width: 0.012inch; Radiation Hardening: No; REACH SVHC: Unknown; Lead Free: Lead Free; ComponentLink1URL: https://datasheet.ciiva.com/2577/crcw0201e3-2577350.pdf?src-supplier=Digi-Key; ComponentLink1Description: https://datasheet.ciiva.com/2577/crcw0201e3-2577350.pdf?src-supplier=Digi-Key; ComponentLink2URL: https://datasheet.ciiva.com/22675/1700795-22675865.pdf?src-supplier=Element14; ComponentLink2Description: https://datasheet.ciiva.com/22675/1700795-22675865.pdf?src-supplier=Element14; ComponentLink3URL: https://datasheet.ciiva.com/7670/1719906-7670701.pdf?src-supplier=Element14; ComponentLink3Description: https://datasheet.ciiva.com/7670/1719906-7670701.pdf?src-supplier=Element14; ComponentLink4URL: https://datasheet.ciiva.com/7670/1719906-7670700.pdf?src-supplier=Element14; ComponentLink4Description: https://datasheet.ciiva.com/7670/1719906-7670700.pdf?src-supplier=Element14
R64 R70 R77 = R0201: Manufacturer 1: Multicomp; Manufacturer Part Number 1: MCWR02X1001FAL; VOLTAGE: 0V; Description: MULTICOMP         MCWR02X1001FAL             SMD Chip Resistor, Thick Film, 1 kohm, 25 V, 0201 [0603 Metric], 50 mW,  1%, MCWR Series; Voltage Rating: 25V; Resistance: 1kR; Power Rating: 50mW; Tolerance: 1%; Temperature Coefficient: 100ppm/°C; Supplier 1: Farnell; Supplier Part Number 1: 2447064; Stock 1: 75000; Pricing 1: 15000=0,00230, 75000=0,00210, 150000=0,00190 (EUR); RoHS: No; Case/Package: 0201; Case Code (Metric): 0603; Case Code (Imperial): 0201; Packaging: Cut Tape; Composition: Thick Film; Voltage Rating (DC): 25V; REACH SVHC: No SVHC; ComponentLink1URL: http://www.farnell.com/datasheets/1849611.pdf?src-supplier=Element14; ComponentLink1Description: http://www.farnell.com/datasheets/1849611.pdf?src-supplier=Element14
R65 R72 R74 R75 = R0201: Manufacturer 1: Multicomp; Manufacturer Part Number 1: MCRE000148; VOLTAGE: 0V; Description: MULTICOMP - MCRE000148 - RES, 2K2, 1%, 0.05W, 0201, THICK FILM; Resistance: 2.2kR; Power Rating: 50mW; Tolerance: 1%; Voltage Rating: 25V; Temperature Coefficient: 200ppm/°C; Supplier 1: Farnell; Supplier Part Number 1: 1711624; Stock 1: 100; Pricing 1: 10=0,01730, 100=0,01040, 500=0,00740, 2500=0,00580, 7500=0,00470 (EUR); RoHS: Yes; Case/Package: SMD/SMT; Case Code (Metric): 0603; Case Code (Imperial): 0201; Min Operating Temperature: -55°C; Max Operating Temperature: 125°C; Packaging: Tape and Reel; Composition: Thick Film; Voltage Rating (DC): 25V; Width: 0.6mm; REACH SVHC: Yes; ComponentLink1URL: https://datasheet.ciiva.com/22689/1729044-22689526.pdf?src-supplier=Element14; ComponentLink1Description: https://datasheet.ciiva.com/22689/1729044-22689526.pdf?src-supplier=Element14
R66 R68 = R0201: Manufacturer 1: Multicomp; Manufacturer Part Number 1: MCWR02X1003FAL; VOLTAGE: 0V; Description: MULTICOMP - MCWR02X1003FAL - RES, 100K, 1%, 0.05W, THICK FILM; Resistance: 100kR; Voltage Rating: 25V; Power Rating: 50mW; Tolerance: 1%; Temperature Coefficient: 100ppm/°C; Supplier 1: Farnell; Supplier Part Number 1: 2447751; Stock 1: 626; Pricing 1: 10=0,01110, 100=0,00670, 500=0,00470, 2500=0,00370, 7500=0,00300 (EUR); RoHS: No; Case/Package: 0201; Case Code (Metric): 0603; Case Code (Imperial): 0201; Packaging: Cut Tape; Composition: Thick Film; Voltage Rating (DC): 25V; REACH SVHC: No SVHC; ComponentLink1URL: http://www.farnell.com/datasheets/2360050.pdf?src-supplier=Farnell; ComponentLink1Description: http://www.farnell.com/datasheets/2360050.pdf?src-supplier=Farnell; ComponentLink2URL: http://www.farnell.com/datasheets/1849611.pdf?src-supplier=Element14; ComponentLink2Description: http://www.farnell.com/datasheets/1849611.pdf?src-supplier=Element14
R67 R71 R78 = R0201: Manufacturer 1: Multicomp; Manufacturer Part Number 1: MCRE000164; VOLTAGE: 0V; Description: MULTICOMP   MCRE000164   Surface Mount Chip Resistor, Thick Film, MCRE Series, 10 kohm, 50 mW,  1%, 25 V; Resistance: 10kR; Tolerance: 1%; Temperature Coefficient: 200ppm/°C; Power Rating: 50mW; Voltage Rating: 25V; Supplier 1: Farnell; Supplier Part Number 1: 1711641; Stock 1: 135743; Pricing 1: 10=0,01690, 100=0,01010, 500=0,00720, 2500=0,00570, 7500=0,00460 (EUR); RoHS: Yes; Case/Package: SMD/SMT; Case Code (Metric): 0603; Case Code (Imperial): 0201; Min Operating Temperature: -55°C; Max Operating Temperature: 125°C; Packaging: Cut Tape; Composition: Thick Film; Voltage Rating (DC): 25V; Width: 0.6mm; REACH SVHC: No SVHC; ComponentLink1URL: https://datasheet.ciiva.com/7881/1729044-7881565.pdf?src-supplier=Element14; ComponentLink1Description: https://datasheet.ciiva.com/7881/1729044-7881565.pdf?src-supplier=Element14; ComponentLink2URL: https://datasheet.ciiva.com/46391/1636793-46391341.pdf?src-supplier=Element14; ComponentLink2Description: https://datasheet.ciiva.com/46391/1636793-46391341.pdf?src-supplier=Element14; ComponentLink3URL: https://datasheet.ciiva.com/7881/1729044-7881566.pdf?src-supplier=Element14; ComponentLink3Description: https://datasheet.ciiva.com/7881/1729044-7881566.pdf?src-supplier=Element14
R69 = R0201: Manufacturer 1: Vishay; Manufacturer Part Number 1: CRCW02014K70FNED; VOLTAGE: 0V; Description: RES SMD 4.7K OHM 1% 1/20W 0201; Voltage Rating: 30V; Resistance: 4.7kR; Tolerance: 1%; Power Rating: 50mW; Temperature Coefficient: 200ppm/°C; Supplier 1: Farnell; Supplier Part Number 1: 2120925; Stock 1: 60000; Pricing 1: 10000=0,00510, 50000=0,00430, 100000=0,00420 (EUR); RoHS: Yes; Case/Package: 0201; Contact Plating: Tin; Case Code (Metric): 0603; Case Code (Imperial): 0201; Min Operating Temperature: -55°C; Max Operating Temperature: 155°C; Packaging: Tape and Reel; Composition: Thick Film; Military Standard: Not; Voltage Rating (DC): 30V; Length: 0.6mm; Depth: 0.3mm; Radiation Hardening: No; REACH SVHC: Unknown; Lead Free: Lead Free; ComponentLink1URL: https://datasheet.ciiva.com/8079/1719906-8079639.pdf?src-supplier=Element14; ComponentLink1Description: https://datasheet.ciiva.com/8079/1719906-8079639.pdf?src-supplier=Element14; ComponentLink2URL: https://datasheet.ciiva.com/8079/1719906-8079640.pdf?src-supplier=Element14; ComponentLink2Description: https://datasheet.ciiva.com/8079/1719906-8079640.pdf?src-supplier=Element14; ComponentLink3URL: https://datasheet.ciiva.com/22682/1700795-22682633.pdf?src-supplier=Element14; ComponentLink3Description: https://datasheet.ciiva.com/22682/1700795-22682633.pdf?src-supplier=Element14; ComponentLink4URL: https://datasheet.ciiva.com/22700/1719906-22700348.pdf?src-supplier=Element14; ComponentLink4Description: https://datasheet.ciiva.com/22700/1719906-22700348.pdf?src-supplier=Element14
R73 = R0805: Manufacturer 1: Multicomp; Manufacturer Part Number 1: MC0805S8F0000T5E; VOLTAGE: 0V; Description: RESISTOR, THICK FILM, JUMPER, 0 OHM, 125mW, 1%; Resistance: 0mR; Power Rating: 125mW; Tolerance: 1%; Voltage Rating: 150V; Temperature Coefficient: 100ppm/°C; Supplier 1: Farnell; Supplier Part Number 1: 2371696; Stock 1: 700000; Pricing 1: 5000=0,00530, 10000=0,00440, 25000=0,00370 (EUR); RoHS: Yes; Case/Package: 0805; Case Code (Metric): 2012; Case Code (Imperial): 0805; Packaging: Cut Tape; Composition: Thick Film; Voltage Rating (DC): 150V; REACH SVHC: Unknown; ComponentLink1URL: https://datasheet.ciiva.com/7777/ta-677-7777110.pdf?src-supplier=Element14; ComponentLink1Description: https://datasheet.ciiva.com/7777/ta-677-7777110.pdf?src-supplier=Element14; ComponentLink2URL: https://datasheet.ciiva.com/6063/ta-677-6063978.pdf?src-supplier=Farnell; ComponentLink2Description: https://datasheet.ciiva.com/6063/ta-677-6063978.pdf?src-supplier=Farnell; ComponentLink3URL: https://datasheet.ciiva.com/28677/1509465-28677389.pdf?src-supplier=Element14; ComponentLink3Description: https://datasheet.ciiva.com/28677/1509465-28677389.pdf?src-supplier=Element14; ComponentLink4URL: https://datasheet.ciiva.com/22673/1509465-22673047.pdf?src-supplier=Element14; ComponentLink4Description: https://datasheet.ciiva.com/22673/1509465-22673047.pdf?src-supplier=Element14
R76 = R0201: Manufacturer 1: Multicomp; Manufacturer Part Number 1: MCRE000195; VOLTAGE: 0V; Description: MULTICOMP - MCRE000195 - RES COUCHE EPAISSE 200K 1% 0.05W 0201; Voltage Rating (DC): 25V; Resistance: 200kR; Tolerance: 1%; Temperature Coefficient: 200ppm/°C; Power Rating: 50mW; Supplier 1: Farnell; Supplier Part Number 1: 1711676; Stock 1: 12447; Pricing 1: 10=0,01730, 100=0,01040, 500=0,00740, 2500=0,00580, 7500=0,00470 (EUR); RoHS: Yes; Case Code (Metric): 0603; Case Code (Imperial): 0201; Packaging: Tape and Reel; Composition: Thick Film; Voltage Rating: 25V; REACH SVHC: Yes; ComponentLink1URL: https://datasheet.ciiva.com/7942/1729044-7942812.pdf?src-supplier=Element14; ComponentLink1Description: https://datasheet.ciiva.com/7942/1729044-7942812.pdf?src-supplier=Element14; ComponentLink2URL: https://datasheet.ciiva.com/7942/1729044-7942813.pdf?src-supplier=Element14; ComponentLink2Description: https://datasheet.ciiva.com/7942/1729044-7942813.pdf?src-supplier=Element14; ComponentLink3URL: https://datasheet.ciiva.com/22686/1729044-22686959.pdf?src-supplier=Element14; ComponentLink3Description: https://datasheet.ciiva.com/22686/1729044-22686959.pdf?src-supplier=Element14
TVS1 = B72590D0050H160: Manufacturer 1: TDK EPCOS; Direction: Bidirectional; Capacitance: 0.9pF; Reverse Standoff Voltage: 5.6V; Reverse Breakdown Voltage: 150V; Leakage Current: 1uA; Number of Elements: 1; Peak Pulse Current: 1A; Test Current: 1mA; Element Configuration: Single; Supplier 1: Digi-Key; Supplier Part Number 1: 495-3684-1-ND; Manufacturer Part Number 1: B72590D0050H160; Stock 1: 99503; Pricing 1: 1=0,41000, 10=0,29900, 25=0,23200, 100=0,17580, 250=0,12440, 500=0,09952, 1000=0,07629, 2500=0,06634, 5000=0,05971 (USD); RoHS: Yes; Mount: Surface Mount; Number of Pins: 2; Min Operating Temperature: -40°C; Max Operating Temperature: 85°C; Packaging: Tape and Reel; Polarity: Bidirectional; Working Voltage: 5.6V; Length: 1.15mm; Depth: 0.6mm; Radiation Hardening: No; ComponentLink1URL: http://components.arrow.com/part/dataview/0323_01960482?src-supplier=Arrow+Europe; ComponentLink1Description: http://components.arrow.com/part/dataview/0323_01960482?src-supplier=Arrow+Europe; ComponentLink2URL: https://en.tdk.eu/inf/75/ds/High_speed_series.pdf?src-supplier=Arrow; ComponentLink2Description: https://en.tdk.eu/inf/75/ds/High_speed_series.pdf?src-supplier=Arrow; ComponentLink3URL: https://en.tdk.eu/inf/75/ds/High_speed_series.pdf?src-supplier=Digi-Key; ComponentLink3Description: https://en.tdk.eu/inf/75/ds/High_speed_series.pdf?src-supplier=Digi-Key; ComponentLink4URL: http://www.farnell.com/datasheets/1706828.pdf?src-supplier=Newark; ComponentLink4Description: http://www.farnell.com/datasheets/1706828.pdf?src-supplier=Newark; ComponentLink5URL: https://en.tdk.eu/inf/75/ds/High_speed_series.pdf?src-supplier=Verical; ComponentLink5Description: https://en.tdk.eu/inf/75/ds/High_speed_series.pdf?src-supplier=Verical; ComponentLink6URL: https://en.tdk.eu/inf/75/ds/High_speed_series.pdf?src-supplier=Quest; ComponentLink6Description: https://en.tdk.eu/inf/75/ds/High_speed_series.pdf?src-supplier=Quest; ComponentLink7URL: https://en.tdk.eu/inf/75/ds/High_speed_series.pdf?src-supplier=TTI; ComponentLink7Description: https://en.tdk.eu/inf/75/ds/High_speed_series.pdf?src-supplier=TTI
U18 = MC32BC3770CSR2: Manufacturer 1: NXP Freescale; Number of Cells: 1; Max Supply Voltage: 6.2V; Interface: I2C; Max Charge Current: 2A; Battery Pack Voltage: 4.475V; Supplier 1: Farnell; Supplier Part Number 1: 2890310; Manufacturer Part Number 1: MC32BC3770CSR2; Stock 1: 0; Pricing 1: 1=2,59000, 10=2,07000, 25=1,86000, 50=1,79000, 100=1,72000, 250=1,69000, 500=1,49000, 1000=1,25000 (EUR); RoHS: No; Min Operating Temperature: -40°C; Max Operating Temperature: 85°C; Packaging: Tape and Reel; ComponentLink1URL: http://www.freescale.com/webapp/webapp/search.partparamdetail.framework?PART_NUMBER=MC32BC3770CSR2&buyNow=false&fromSearch=true&lang_cd=&src-supplier=Avnet; ComponentLink1Description: http://www.freescale.com/webapp/webapp/search.partparamdetail.framework?PART_NUMBER=MC32BC3770CSR2&buyNow=false&fromSearch=true&lang_cd=&src-supplier=Avnet; ComponentLink2URL: https://www.nxp.com/files-static/analog/doc/data_sheet/MC32BC3770.pdf?src-supplier=Digi-Key; ComponentLink2Description: https://www.nxp.com/files-static/analog/doc/data_sheet/MC32BC3770.pdf?src-supplier=Digi-Key
Z1 = Zener: Manufacturer 1: ON Semiconductor; Manufacturer Part Number 1: MM5Z5V1ST1G; Tolerance: 2%; Max Power Dissipation: 200mW; Forward Voltage: 900mV; Zener Voltage: 5.09V; Impedance: 60R; Zener Current: 10mA; Peak Reverse Current: 2uA; Element Configuration: Single; Voltage Rating (DC): 5.1V; Power Rating: 100mW; Test Current: 5mA; ESD Protection: Yes; Supplier 1: Farnell; Supplier Part Number 1: 2463606; Stock 1: 330; Pricing 1: 5=0,18600, 50=0,17600, 100=0,07430, 500=0,04640, 1500=0,04170 (EUR); RoHS: Yes; Case/Package: SOD-523-2; Number of Pins: 2; Material: Plastic; Contact Plating: Tin,Matte; Min Operating Temperature: -65°C; Max Operating Temperature: 150°C; Packaging: Tape and Reel; Package Quantity: 1; Voltage Tolerance: 2%; Max Reverse Leakage Current: 2uA; Power Dissipation: 200mW; Working Voltage: 5.1V; Length: 1.3mm; Height: 0.7mm; Width: 0.9mm; Radiation Hardening: No; Lead Free: Lead Free; REACH SVHC: No SVHC; ComponentLink1URL: https://datasheet.ciiva.com/895/mm5z2v4st1-d-895152.pdf?src-supplier=Digi-Key; ComponentLink1Description: https://datasheet.ciiva.com/895/mm5z2v4st1-d-895152.pdf?src-supplier=Digi-Key; ComponentLink2URL: https://datasheet.ciiva.com/30478/0900766b81276ad6-30478656.pdf?src-supplier=RSComponents; ComponentLink2Description: https://datasheet.ciiva.com/30478/0900766b81276ad6-30478656.pdf?src-supplier=RSComponents; ComponentLink3URL: https://datasheet.ciiva.com/34301/799852-34301545.pdf?src-supplier=Jameco; ComponentLink3Description: https://datasheet.ciiva.com/34301/799852-34301545.pdf?src-supplier=Jameco; ComponentLink4URL: https://datasheet.ciiva.com/895/mm5z2v4st1-d-895153.pdf?src-supplier=Digi-Key; ComponentLink4Description: https://datasheet.ciiva.com/895/mm5z2v4st1-d-895153.pdf?src-supplier=Digi-Key; ComponentLink5URL: https://datasheet.ciiva.com/16382/mm5z2v4st1-d-16382598.pdf?src-supplier=Future+Electronics; ComponentLink5Description: https://datasheet.ciiva.com/16382/mm5z2v4st1-d-16382598.pdf?src-supplier=Future+Electronics; ComponentLink6URL: https://datasheet.ciiva.com/49048/1876692-49048022.pdf?src-supplier=Element14; ComponentLink6Description: https://datasheet.ciiva.com/49048/1876692-49048022.pdf?src-supplier=Element14; ComponentLink7URL: https://datasheet.ciiva.com/10630/mm5z2v4st1-d-10630231.pdf?src-supplier=Avnet; ComponentLink7Description: https://datasheet.ciiva.com/10630/mm5z2v4st1-d-10630231.pdf?src-supplier=Avnet; ComponentLink8URL: https://datasheet.ciiva.com/25928/mm5z2v4st1-d-25928314.pdf?src-supplier=Avnet+Europe; ComponentLink8Description: https://datasheet.ciiva.com/25928/mm5z2v4st1-d-25928314.pdf?src-supplier=Avnet+Europe; ComponentLink9URL: https://datasheet.ciiva.com/895/mm5z2v4st1-d-895151.pdf?src-supplier=Digi-Key; ComponentLink9Description: https://datasheet.ciiva.com/895/mm5z2v4st1-d-895151.pdf?src-supplier=Digi-Key
J8 = JST_XH_3: Supplier 1: Farnell; Supplier Part Number 1: 1516277
U17 = AP3417CDNTR-G1: Supplier 1: Mouser; Supplier Part Number 1: 621-AP3417CDNTR-G1